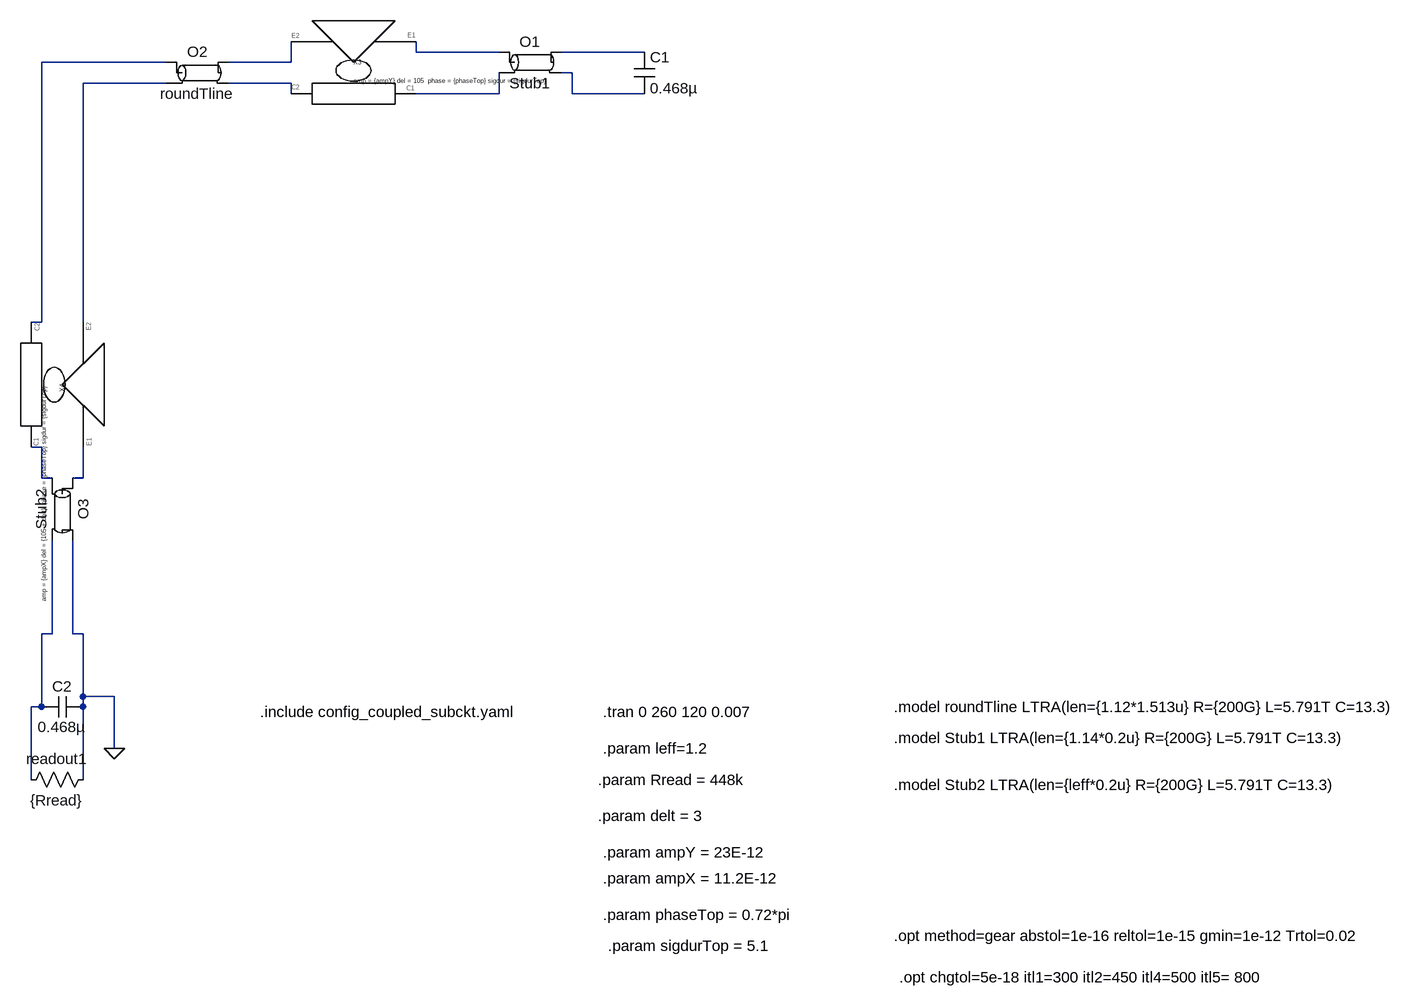
[diagram p0: schematic 2_norm_antennasTest.asc]
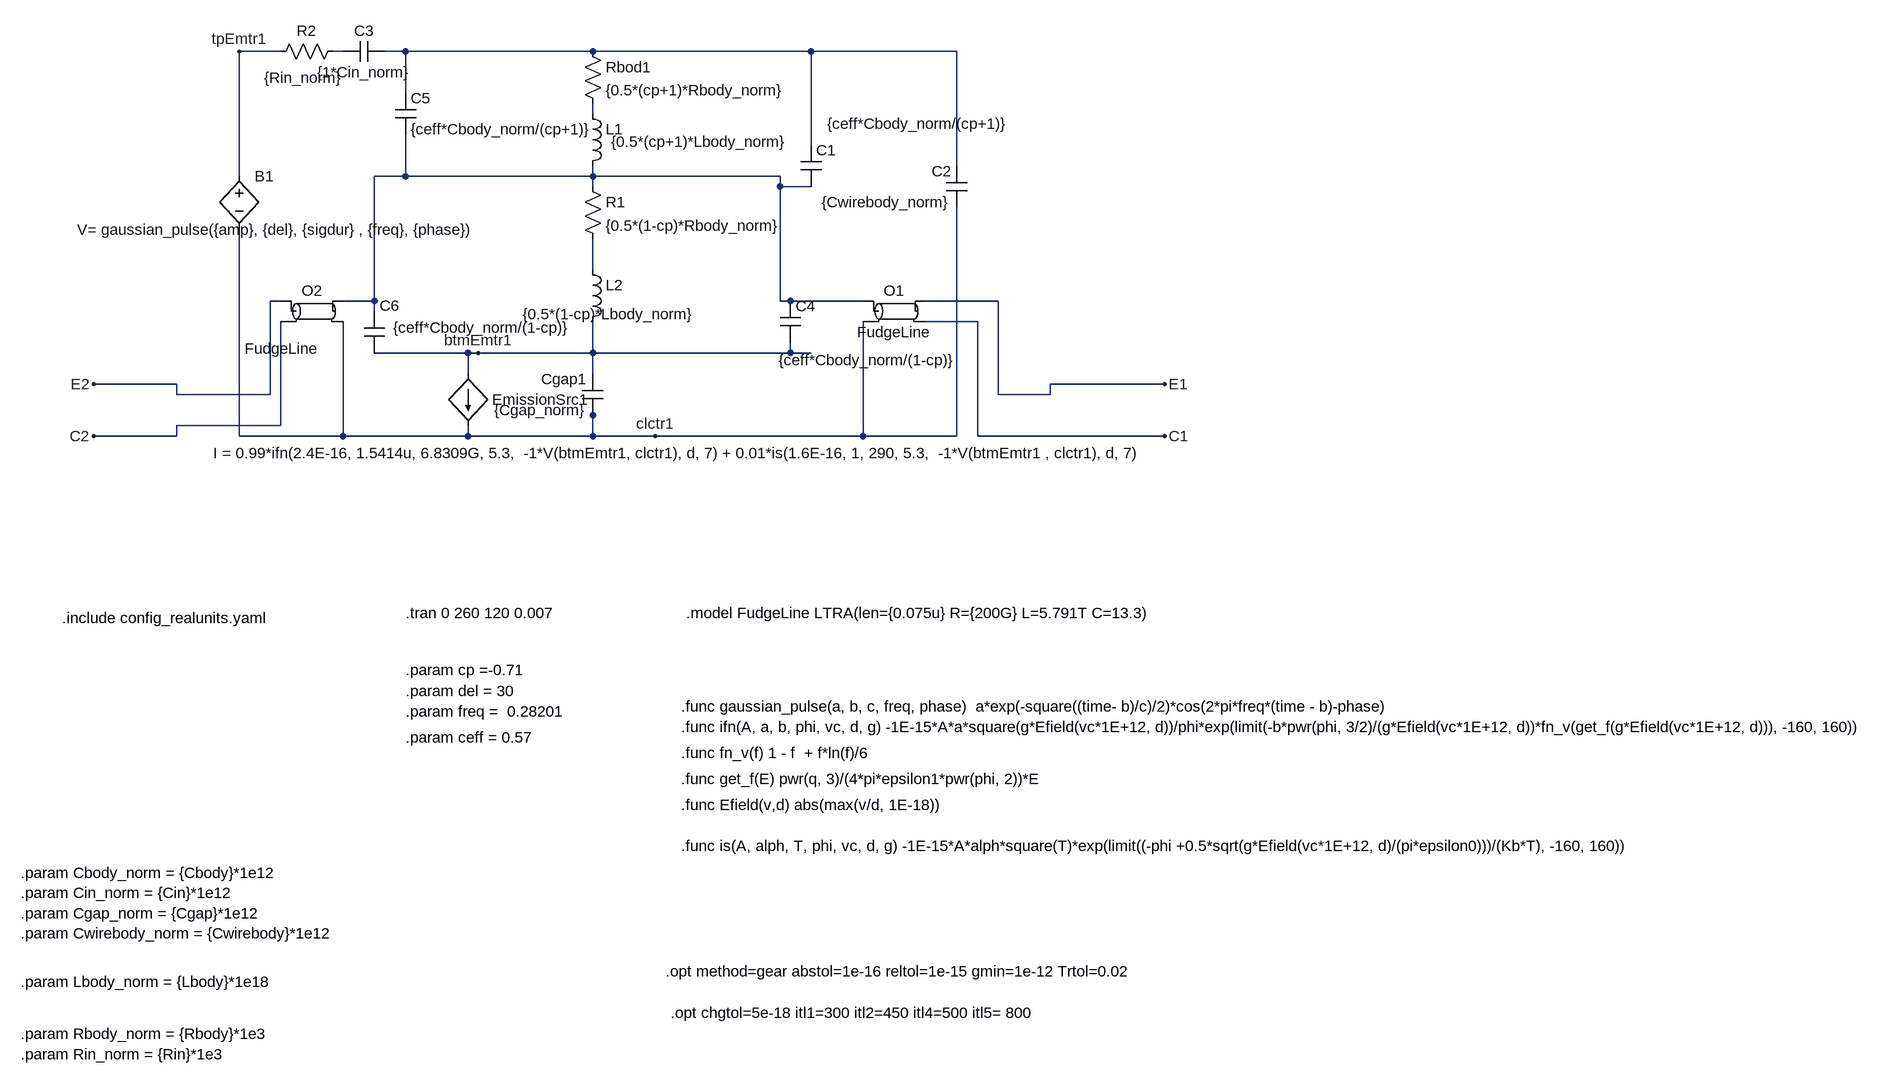
[diagram p1: sub-circuit single_antenna_normalized.asc]
2_norm_antennasTest.asc, the LTspice schematic file:
Version 4.1
SHEET 1 1380 688
WIRE -224 -752 -224 -768
WIRE -96 -752 -224 -752
WIRE 128 -752 0 -752
WIRE -608 -736 -800 -736
WIRE -416 -736 -416 -768
WIRE -416 -736 -512 -736
WIRE 16 -720 0 -720
WIRE -608 -704 -736 -704
WIRE -416 -704 -512 -704
WIRE -416 -688 -416 -704
WIRE -96 -688 -96 -720
WIRE -96 -688 -224 -688
WIRE 16 -688 16 -720
WIRE 128 -688 16 -688
WIRE -800 -336 -800 -736
WIRE -800 -336 -816 -336
WIRE -736 -336 -736 -704
WIRE -800 -144 -816 -144
WIRE -800 -96 -800 -144
WIRE -784 -96 -800 -96
WIRE -736 -96 -736 -144
WIRE -736 -96 -752 -96
WIRE -784 144 -784 0
WIRE -784 144 -800 144
WIRE -752 144 -752 0
WIRE -736 144 -752 144
WIRE -736 240 -736 144
WIRE -688 240 -736 240
WIRE -800 256 -800 144
WIRE -800 256 -816 256
WIRE -736 256 -736 240
WIRE -688 320 -688 240
WIRE -816 368 -816 256
WIRE -736 368 -736 256
FLAG -688 320 0
SYMBOL ltline -48 -736 R0
SYMATTR InstName O1
SYMATTR Value Stub1
SYMBOL cap 112 -752 R0
SYMATTR InstName C1
SYMATTR Value 0.468µ
SYMBOL ltline -560 -720 R0
SYMATTR InstName O2
SYMATTR Value roundTline
SYMBOL cap -736 240 R90
WINDOW 0 0 32 VBottom 2
WINDOW 3 31 33 VTop 2
SYMATTR InstName C2
SYMATTR Value 0.468µ
SYMBOL res -720 352 R90
WINDOW 0 0 56 VBottom 2
WINDOW 3 32 56 VTop 2
SYMATTR InstName readout1
SYMATTR Value {Rread}
SYMBOL ltline -768 -48 R90
SYMATTR InstName O3
SYMATTR Value Stub2
SYMBOL single_antenna_normalized -320 -736 R0
WINDOW 0 0 0 Left 0
WINDOW 39 0 28 Left 0
SYMATTR InstName X3
SYMATTR SpiceLine amp = {ampY} del = 105  phase = {phaseTop} sigdur = {sigdurTop}
SYMBOL single_antenna_normalized -768 -240 R90
WINDOW 0 0 0 Left 0
WINDOW 39 0 28 Left 0
SYMATTR InstName X4
SYMATTR SpiceLine amp = {ampX} del = {105 + delt}  phase = {phaseTop} sigdur = {sigdurTop}
TEXT 64 264 Left 2 !.tran 0 260 120 0.007
TEXT 56 424 Left 2 !.param delt = 3
TEXT 56 368 Left 2 !.param Rread = 448k
TEXT 64 320 Left 2 !.param leff=1.2
TEXT -464 264 Left 2 !.include config_coupled_subckt.yaml
TEXT 512 256 Left 2 !.model roundTline LTRA(len={1.12*1.513u} R={200G} L=5.791T C=13.3)
TEXT 512 304 Left 2 !.model Stub1 LTRA(len={1.14*0.2u} R={200G} L=5.791T C=13.3)
TEXT 512 376 Left 2 !.model Stub2 LTRA(len={leff*0.2u} R={200G} L=5.791T C=13.3)
TEXT 512 608 Left 2 !.opt method=gear abstol=1e-16 reltol=1e-15 gmin=1e-12 Trtol=0.02
TEXT 520 672 Left 2 !.opt chgtol=5e-18 itl1=300 itl2=450 itl4=500 itl5= 800
TEXT 64 480 Left 2 !.param ampY = 23E-12
TEXT 64 520 Left 2 !.param ampX = 11.2E-12
TEXT 64 576 Left 2 !.param phaseTop = 0.72*pi
TEXT 72 624 Left 2 !.param sigdurTop = 5.1

single_antenna_normalized.asc, the sub-circuit schematic file:
Version 4.1
SHEET 1 1804 1060
WIRE -912 -496 -976 -496
WIRE -816 -496 -832 -496
WIRE -720 -496 -752 -496
WIRE -432 -496 -720 -496
WIRE -96 -496 -432 -496
WIRE 128 -496 -96 -496
WIRE -720 -432 -720 -496
WIRE -432 -400 -432 -416
WIRE -96 -352 -96 -496
WIRE 128 -320 128 -496
WIRE -976 -304 -976 -496
WIRE -720 -304 -720 -368
WIRE -720 -304 -768 -304
WIRE -432 -304 -432 -320
WIRE -432 -304 -720 -304
WIRE -144 -304 -432 -304
WIRE -432 -288 -432 -304
WIRE -144 -288 -144 -304
WIRE -96 -288 -144 -288
WIRE -432 -160 -432 -208
WIRE -912 -112 -928 -112
WIRE -768 -112 -768 -304
WIRE -768 -112 -816 -112
WIRE -144 -112 -144 -288
WIRE -128 -112 -144 -112
WIRE -16 -112 -128 -112
WIRE 192 -112 80 -112
WIRE -768 -96 -768 -112
WIRE 160 -80 80 -80
WIRE -624 -32 -768 -32
WIRE -608 -32 -624 -32
WIRE -432 -32 -432 -80
WIRE -432 -32 -608 -32
WIRE -128 -32 -128 -48
WIRE -128 -32 -432 -32
WIRE -96 -32 -128 -32
WIRE -624 0 -624 -32
WIRE -432 0 -432 -32
WIRE -1072 16 -1200 16
WIRE 448 16 272 16
WIRE -1072 32 -1072 16
WIRE -928 32 -928 -112
WIRE -928 32 -1072 32
WIRE 192 32 192 -112
WIRE 272 32 272 16
WIRE 272 32 192 32
WIRE -432 64 -432 48
WIRE -912 80 -912 -80
WIRE -912 80 -1072 80
WIRE -1072 96 -1072 80
WIRE -1072 96 -1200 96
WIRE -976 96 -976 -224
WIRE -816 96 -816 -80
WIRE -816 96 -976 96
WIRE -624 96 -624 80
WIRE -624 96 -816 96
WIRE -432 96 -432 64
WIRE -432 96 -624 96
WIRE -336 96 -432 96
WIRE -16 96 -16 -80
WIRE -16 96 -336 96
WIRE 128 96 128 -256
WIRE 128 96 -16 96
WIRE 160 96 160 -80
WIRE 448 96 160 96
FLAG -608 -32 btmEmtr1
FLAG -336 96 clctr1
FLAG -976 -496 tpEmtr1
FLAG -1200 16 E2
FLAG -1200 96 C2
FLAG 448 16 E1
FLAG 448 96 C1
SYMBOL cap -112 -352 R0
WINDOW 3 41 -33 Left 2
SYMATTR Value {ceff*Cbody_norm/(cp+1)}
SYMATTR InstName C1
SYMBOL cap -416 64 R180
WINDOW 0 24 56 Left 2
WINDOW 3 24 8 Left 2
SYMATTR InstName Cgap1
SYMATTR Value {Cgap_norm}
SYMBOL cap 144 -256 R180
WINDOW 0 24 56 Left 2
WINDOW 3 24 8 Left 2
SYMATTR InstName C2
SYMATTR Value {Cwirebody_norm}
SYMBOL res -448 -512 R0
SYMATTR InstName Rbod1
SYMATTR Value {0.5*(cp+1)*Rbody_norm}
SYMBOL res -448 -304 R0
SYMATTR InstName R1
SYMATTR Value {0.5*(1-cp)*Rbody_norm}
SYMBOL ind -448 -416 R0
WINDOW 3 44 59 Left 2
SYMATTR Value {0.5*(cp+1)*Lbody_norm}
SYMATTR InstName L1
SYMATTR SpiceLine Rser=1m
SYMBOL ind -448 -176 R0
WINDOW 3 -92 84 Left 2
SYMATTR Value {0.5*(1-cp)*Lbody_norm}
SYMATTR InstName L2
SYMATTR SpiceLine Rser=1m
SYMBOL res -816 -512 R90
WINDOW 0 0 56 VBottom 2
WINDOW 3 41 61 VTop 2
SYMATTR InstName R2
SYMATTR Value {Rin_norm}
SYMBOL cap -752 -512 R90
WINDOW 0 0 32 VBottom 2
WINDOW 3 32 32 VTop 2
SYMATTR InstName C3
SYMATTR Value {1*Cin_norm}
SYMBOL cap -144 -112 R0
WINDOW 3 -2 91 Left 2
SYMATTR Value {ceff*Cbody_norm/(1-cp)}
SYMATTR InstName C4
SYMBOL cap -736 -432 R0
SYMATTR InstName C5
SYMATTR Value {ceff*Cbody_norm/(cp+1)}
SYMBOL cap -784 -96 R0
WINDOW 0 24 -9 Left 2
WINDOW 3 45 25 Left 2
SYMATTR InstName C6
SYMATTR Value {ceff*Cbody_norm/(1-cp)}
SYMBOL ltline 32 -96 R0
SYMATTR InstName O1
SYMATTR Value FudgeLine
SYMBOL ltline -864 -96 R0
WINDOW 3 -46 42 Top 2
SYMATTR Value FudgeLine
SYMATTR InstName O2
SYMBOL bv -976 -320 R0
WINDOW 3 -249 98 Left 2
SYMATTR Value V= gaussian_pulse({amp}, {del}, {sigdur} , {freq}, {phase})
SYMATTR InstName B1
SYMBOL bi -624 0 R0
WINDOW 3 -392 122 Left 2
WINDOW 0 37 40 Left 2
SYMATTR Value I = 0.99*ifn(2.4E-16, 1.5414u, 6.8309G, 5.3,  -1*V(btmEmtr1, clctr1), d, 7) + 0.01*is(1.6E-16, 1, 290, 5.3,  -1*V(btmEmtr1 , clctr1), d, 7)
SYMATTR InstName EmissionSrc1
TEXT -1248 376 Left 2 !.include config_realunits.yaml
TEXT -720 368 Left 2 !.tran 0 260 120 0.007
TEXT -720 456 Left 2 !.param cp =-0.71
TEXT -296 512 Left 2 !.func gaussian_pulse(a, b, c, freq, phase)  a*exp(-square((time- b)/c)/2)*cos(2*pi*freq*(time - b)-phase)
TEXT -720 488 Left 2 !.param del = 30
TEXT -720 520 Left 2 !.param freq =  0.28201
TEXT -288 368 Left 2 !.model FudgeLine LTRA(len={0.075u} R={200G} L=5.791T C=13.3)
TEXT -720 560 Left 2 !.param ceff = 0.57
TEXT -296 584 Left 2 !.func fn_v(f) 1 - f  + f*ln(f)/6
TEXT -296 624 Left 2 !.func get_f(E) pwr(q, 3)/(4*pi*epsilon1*pwr(phi, 2))*E
TEXT -296 544 Left 2 !.func ifn(A, a, b, phi, vc, d, g) -1E-15*A*a*square(g*Efield(vc*1E+12, d))/phi*exp(limit(-b*pwr(phi, 3/2)/(g*Efield(vc*1E+12, d))*fn_v(get_f(g*Efield(vc*1E+12, d))), -160, 160))
TEXT -296 664 Left 2 !.func Efield(v,d) abs(max(v/d, 1E-18))\n \n.func is(A, alph, T, phi, vc, d, g) -1E-15*A*alph*square(T)*exp(limit((-phi +0.5*sqrt(g*Efield(vc*1E+12, d)/(pi*epsilon0)))/(Kb*T), -160, 160))
TEXT -320 920 Left 2 !.opt method=gear abstol=1e-16 reltol=1e-15 gmin=1e-12 Trtol=0.02
TEXT -312 984 Left 2 !.opt chgtol=5e-18 itl1=300 itl2=450 itl4=500 itl5= 800
TEXT -1312 768 Left 2 !.param Cbody_norm = {Cbody}*1e12\n.param Cin_norm = {Cin}*1e12\n.param Cgap_norm = {Cgap}*1e12\n.param Cwirebody_norm = {Cwirebody}*1e12
TEXT -1312 936 Left 2 !.param Lbody_norm = {Lbody}*1e18
TEXT -1312 1016 Left 2 !.param Rbody_norm = {Rbody}*1e3\n.param Rin_norm = {Rin}*1e3

The netlist it stands for:
* 2_norm_antennasTest.asc
O1 N001 N008 N002 N005 Stub1
C1 N002 N005 0.468µ
O2 N003 N006 N004 N007 roundTline
C2 0 N011 0.468µ
readout1 0 N011 {Rread}
O3 N010 N009 0 N011 Stub2
X§X3 N004 N007 N001 N008 single_antenna_normalized params: amp = {ampY} del = 105  phase = {phaseTop} sigdur = {sigdurTop}
X§X4 N006 N003 N010 N009 single_antenna_normalized params: amp = {ampX} del = {105 + delt}  phase = {phaseTop} sigdur = {sigdurTop}

* block symbol definitions
.subckt single_antenna_normalized E2 C2 E1 C1
C1 N002 N004 {ceff*Cbody_norm/(cp+1)}
Cgap1 clctr1 btmEmtr1 {Cgap_norm}
C2 clctr1 N002 {Cwirebody_norm}
Rbod1 N002 N003 {0.5*(cp+1)*Rbody_norm}
R1 N004 N005 {0.5*(1-cp)*Rbody_norm}
L1 N003 N004 {0.5*(cp+1)*Lbody_norm} Rser=1m
L2 N005 btmEmtr1 {0.5*(1-cp)*Lbody_norm} Rser=1m
R2 N001 tpEmtr1 {Rin_norm}
C3 N002 N001 {1*Cin_norm}
C4 N004 btmEmtr1 {ceff*Cbody_norm/(1-cp)}
C5 N002 N004 {ceff*Cbody_norm/(cp+1)}
C6 N004 btmEmtr1 {ceff*Cbody_norm/(1-cp)}
O1 N004 clctr1 E1 C1 FudgeLine
O2 E2 C2 N004 clctr1 FudgeLine
B1 tpEmtr1 clctr1 V= gaussian_pulse({amp}, {del}, {sigdur} , {freq}, {phase})
B§EmissionSrc1 btmEmtr1 clctr1 I = 0.99*ifn(2.4E-16, 1.5414u, 6.8309G, 5.3,  -1*V(btmEmtr1, clctr1), d, 7) + 0.01*is(1.6E-16, 1, 290, 5.3,  -1*V(btmEmtr1 , clctr1), d, 7)
.include config_realunits.yaml
.tran 0 260 120 0.007
.param cp =-0.71
.func gaussian_pulse(a, b, c, freq, phase)  a*exp(-square((time- b)/c)/2)*cos(2*pi*freq*(time - b)-phase)
.param del = 30
.param freq =  0.28201
.model FudgeLine LTRA(len={0.075u} R={200G} L=5.791T C=13.3)
.param ceff = 0.57
.func fn_v(f) 1 - f  + f*ln(f)/6
.func get_f(E) pwr(q, 3)/(4*pi*epsilon1*pwr(phi, 2))*E
.func ifn(A, a, b, phi, vc, d, g) -1E-15*A*a*square(g*Efield(vc*1E+12, d))/phi*exp(limit(-b*pwr(phi, 3/2)/(g*Efield(vc*1E+12, d))*fn_v(get_f(g*Efield(vc*1E+12, d))), -160, 160))
.func Efield(v,d) abs(max(v/d, 1E-18))
.func is(A, alph, T, phi, vc, d, g) -1E-15*A*alph*square(T)*exp(limit((-phi +0.5*sqrt(g*Efield(vc*1E+12, d)/(pi*epsilon0)))/(Kb*T), -160, 160))
.opt method=gear abstol=1e-16 reltol=1e-15 gmin=1e-12 Trtol=0.02
.opt chgtol=5e-18 itl1=300 itl2=450 itl4=500 itl5= 800
.param Cbody_norm = {Cbody}*1e12
.param Cin_norm = {Cin}*1e12
.param Cgap_norm = {Cgap}*1e12
.param Cwirebody_norm = {Cwirebody}*1e12
.param Lbody_norm = {Lbody}*1e18
.param Rbody_norm = {Rbody}*1e3
.param Rin_norm = {Rin}*1e3
.ends single_antenna_normalized

.tran 0 260 120 0.007
.param delt = 3
.param Rread = 448k
.param leff=1.2
.include config_coupled_subckt.yaml
.model roundTline LTRA(len={1.12*1.513u} R={200G} L=5.791T C=13.3)
.model Stub1 LTRA(len={1.14*0.2u} R={200G} L=5.791T C=13.3)
.model Stub2 LTRA(len={leff*0.2u} R={200G} L=5.791T C=13.3)
.opt method=gear abstol=1e-16 reltol=1e-15 gmin=1e-12 Trtol=0.02
.opt chgtol=5e-18 itl1=300 itl2=450 itl4=500 itl5= 800
.param ampY = 23E-12
.param ampX = 11.2E-12
.param phaseTop = 0.72*pi
.param sigdurTop = 5.1
.backanno
.end